# EAGLE schematic microBat (EAGLE 9.5.2)
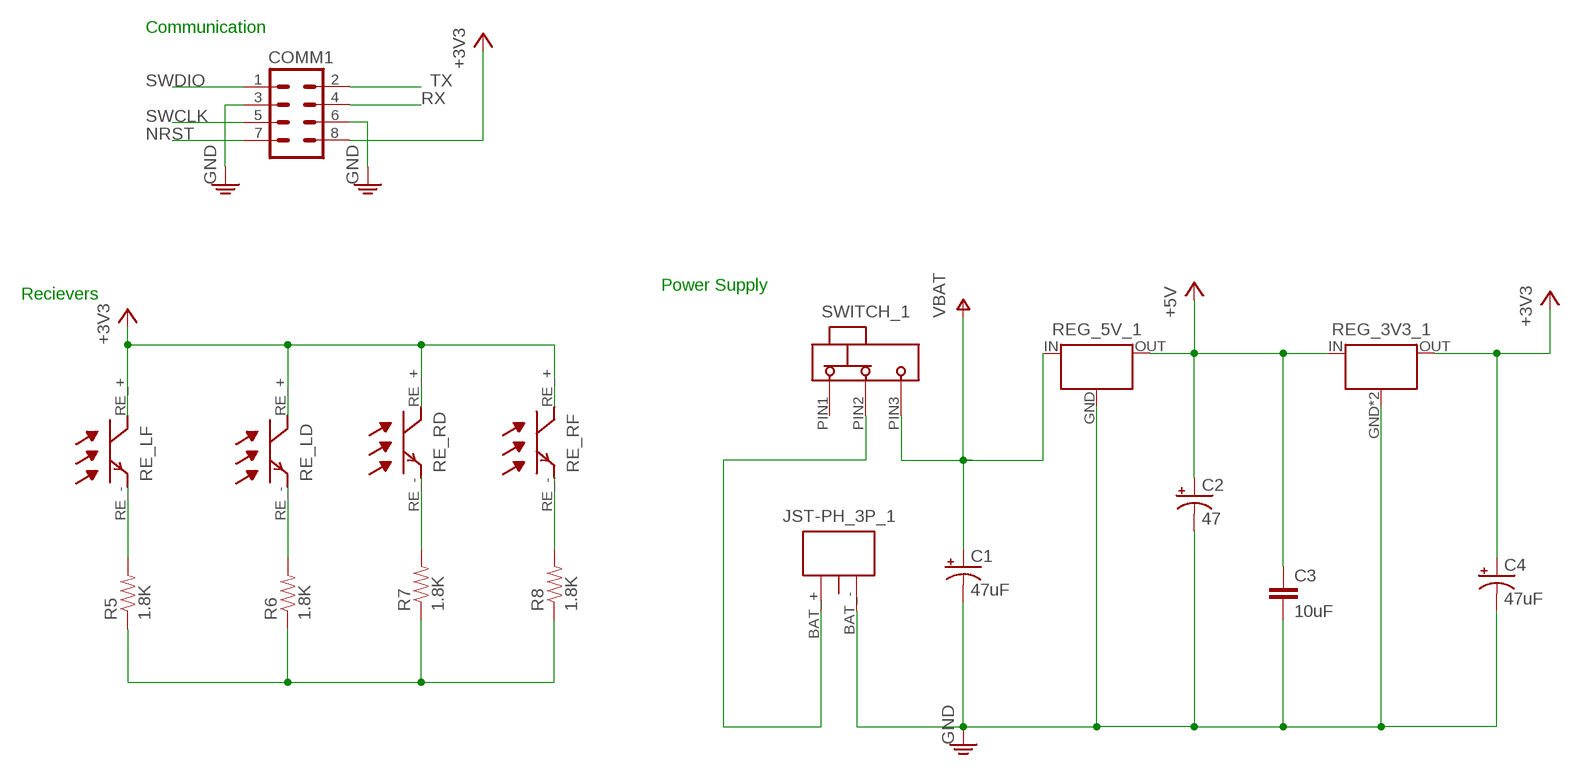
[diagram p0: schematic, sheet 1]

## Parts
C1  47uF  CAP_TANT_1210IN_3528MM  [CAP_TANT_1210IN_3528MM]
C2  47  CAP_TANT_1210IN_3528MM  [CAP_TANT_1210IN_3528MM]
C3  10uF  CAP_CERAMIC_0805IN_2012MM  [0805]
C4  47uF  CAP_TANT_1210IN_3528MM  [CAP_TANT_1210IN_3528MM]
COMM1  M04X2  [2X4]
JST-PH_3P_1  3PIN  [B3B-PH-K-S]
R5  1.8K  RESISTOR_0805IN_2012MM  [0805]
R6  1.8K  RESISTOR_0805IN_2012MM  [0805]
R7  1.8K  RESISTOR_0805IN_2012MM  [0805]
R8  1.8K  RESISTOR_0805IN_2012MM  [0805]
RE_LD  TEFT4300  [RECEIVER]
RE_LF  TEFT4300  [RECEIVER]
RE_RD  TEFT4300  [RECEIVER]
RE_RF  TEFT4300  [RECEIVER]
REG_3V3_1  3V3_REG  [SOT223]
REG_5V_1  REG_5V_MURATA  [5V_REG_MURATA]
SWITCH_1  POLOLU_SWITCH  [POLOLU_SWITCH]

## Nets
+3V3: C4.A(+) COMM1.8 RE_LD.RE_+(C) RE_LF.RE_+(C) RE_RD.RE_+(C) RE_RF.RE_+(C) REG_3V3_1.OUT
+5V: C2.A(+) C3.1 REG_3V3_1.IN REG_5V_1.OUT
GND: C1.C(-) C2.C(-) C3.2 C4.C(-) COMM1.3 COMM1.6 JST-PH_3P_1.BAT_- REG_3V3_1.GND REG_3V3_1.GND2(GND) REG_5V_1.GND
N$2: R5.2 RE_LF.RE_-(E)
N$3: JST-PH_3P_1.BAT_+ SWITCH_1.PIN2
N$4: R6.2 RE_LD.RE_-(E)
N$5: R7.2 RE_RD.RE_-(E)
N$6: R8.2 RE_RF.RE_-(E)
N$7: R5.1 R6.1 R7.1 R8.1
NRST: COMM1.7
RX: COMM1.4
SWCLK: COMM1.5
SWDIO: COMM1.1
TX: COMM1.2
V+: C1.A(+) REG_5V_1.IN SWITCH_1.PIN3 ; supply symbol labelled VBAT
Unconnected: SWITCH_1.PIN1

## Notes on the sheet
- Communication
- Power Supply
- Recievers

## Library data of the parts
C1 C2 C4 = CAP_TANT_1210IN_3528MM:CAP_TANT_1210IN_3528MM
C3 = CAP_CERAMIC_0805IN_2012MM:CAP_CERAMIC_0805IN_2012MM
COMM1 = 2X4_PIN_HEADER:M04X2
JST-PH_3P_1 = BATT_JST-PH_3PIN:3PIN
R5-R8 = RESISTOR_0805IN_2012MM:RESISTOR_0805IN_2012MM
RE_LD RE_LF RE_RD RE_RF = TEFT4300:TEFT4300
REG_3V3_1 = REG_3V3_LM3940:3V3_REG: 1A Low Dropout Regulator for 5V to 3.3V Conversion
REG_5V_1 = REG_5V_MURATA:REG_5V_MURATA
SWITCH_1 = POLOLU_SWITCH:POLOLU_SWITCH